# EAGLE design rs485_board (EAGLE 6.6.0)
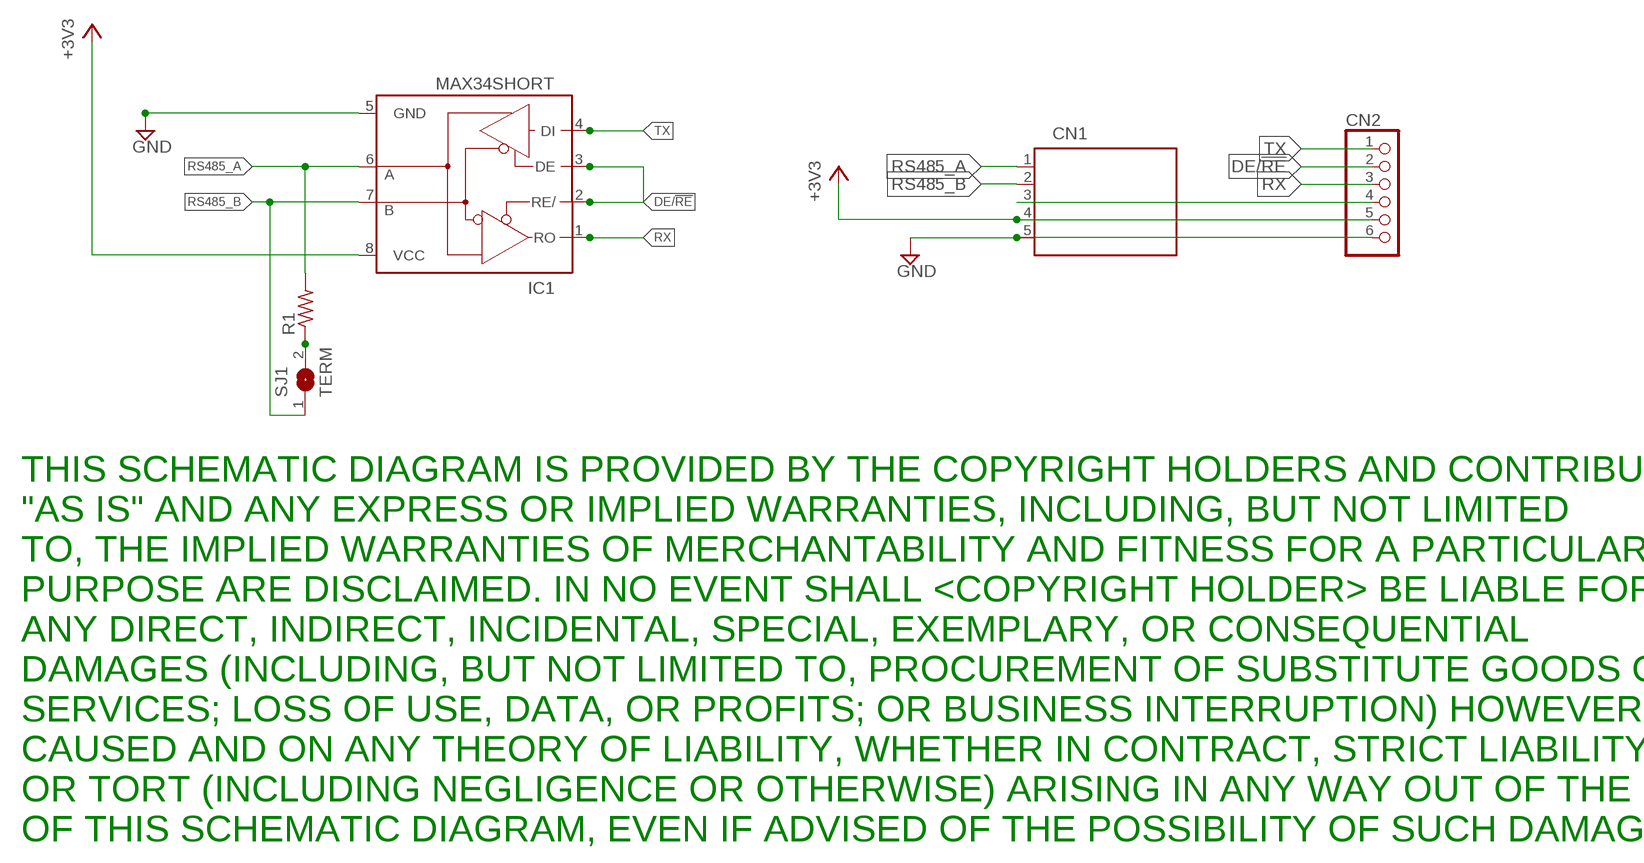
[diagram p0: schematic, sheet 1]

## Parts
CN1  5PINZH  [ZH-5]
CN2  PINHD-1X06_2.54  [1X06]
IC1  MAX34SHORT  [SO08SHORT]
R1  R-US_R0603  [R0603]
SJ1  TERM  SJ  [SJ]

## Nets
+3V3: CN1.4 CN2.5 IC1.8(VCC)
DE/!RE: CN2.2 IC1.2(RE/) IC1.3(DE)
GND: CN1.5 CN2.6 IC1.5(GND)
N$1: CN1.3 CN2.4
N$7: R1.1 SJ1.2
RS485_A: CN1.1 IC1.6(A) R1.2
RS485_B: CN1.2 IC1.7(B) SJ1.1
RX: CN2.3 IC1.1(RO)
TX: CN2.1 IC1.4(DI)

## Notes on the sheet
- THIS SCHEMATIC DIAGRAM IS PROVIDED BY THE COPYRIGHT HOLDERS AND CONTRIBUTORS 
  "AS IS" AND ANY EXPRESS OR IMPLIED WARRANTIES, INCLUDING, BUT NOT LIMITED 
  TO, THE IMPLIED WARRANTIES OF MERCHANTABILITY AND FITNESS FOR A PARTICULAR 
  PURPOSE ARE DISCLAIMED. IN NO EVENT SHALL <COPYRIGHT HOLDER> BE LIABLE FOR 
  ANY DIRECT, INDIRECT, INCIDENTAL, SPECIAL, EXEMPLARY, OR CONSEQUENTIAL 
  DAMAGES (INCLUDING, BUT NOT LIMITED TO, PROCUREMENT OF SUBSTITUTE GOODS OR 
  SERVICES; LOSS OF USE, DATA, OR PROFITS; OR BUSINESS INTERRUPTION) HOWEVER 
  CAUSED AND ON ANY THEORY OF LIABILITY, WHETHER IN CONTRACT, STRICT LIABILITY,
  OR TORT (INCLUDING NEGLIGENCE OR OTHERWISE) ARISING IN ANY WAY OUT OF THE USE
  OF THIS SCHEMATIC DIAGRAM, EVEN IF ADVISED OF THE POSSIBILITY OF SUCH DAMAGE.

## Library data of the parts
CN1 = con-jst:5PIN
CN2 = pinhead-2:PINHD-1X06: PIN HEADER
IC1 = maxim:MAX34*: +5V, Fail-Safe, 40Mbps, Profibus RS-485/RS-422 Transceivers Source: MAX3465-MAX3469.pdf
R1 = rcl:R-US_: RESISTOR, American symbol
SJ1 = jumper:SJ: SMD solder JUMPER

## Net classes
1 power: width 0.254 mm, drill 0.33 mm, clearance 0.152 mm

## Board
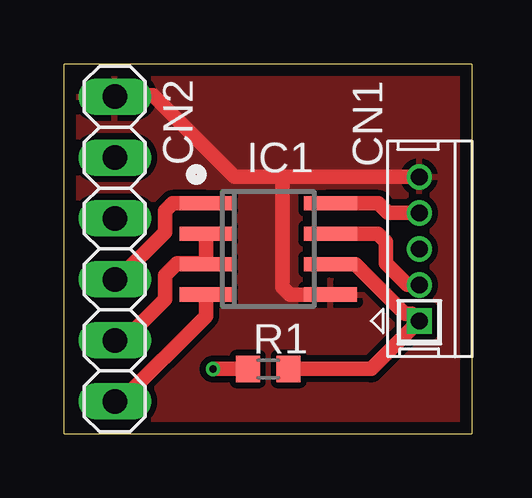
[diagram p1: board, top side]
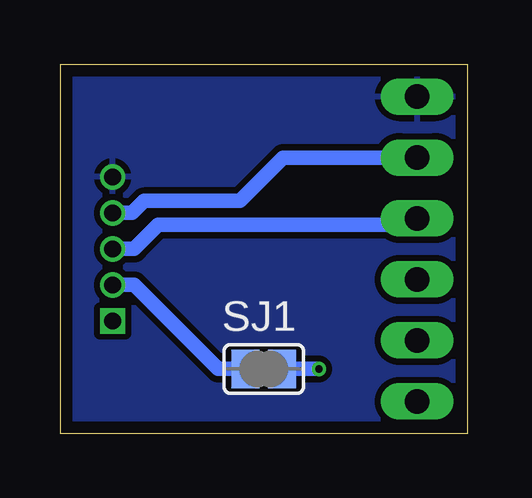
[diagram p2: board, bottom side, seen from below]

Size 17 x 15.4 mm. Coordinates in mm from the lower left corner, seen from the top.
Outline: 0,0 17,0 17,15.4 0,15.4 0,0
Copper layers (1*16): Top 0.035mm / dielectric 1.53mm / Bottom 0.035mm
Design rules "pban_5mil-l2": minimum track width 5mil, minimum drill 0.3mm, track to track 5mil, track to pad 0.229mm, pad to pad 5mil, via to via 5mil, smd to smd 5mil, copper to edge 0.5mm, drill to drill 0.5mm, minimum pad ring 0.15mm, minimum via ring 0.15mm, stop-mask expansion 4mil, vias tented up to drill 0.35mm, thermal gap 10mil

### Footprints (pad centres in the part's own frame; a part is rotated, then mirrored left to right if it is on the bottom)
ZH-5 = drill 0.7 square: 1 -4.5,0 | drill 0.7: 2 -3,0; 3 -1.5,0; 4 0,0; 5 1.5,0
1X06 = drill 1.016 long: 1 -6.35,0; 2 -3.81,0; 3 -1.27,0; 4 1.27,0; 5 3.81,0; 6 6.35,0
SO08SHORT = smd 0.6 x 2.2: 1 -1.905,-2.6; 2 -0.635,-2.6; 3 0.635,-2.6; 4 1.905,-2.6; 5 1.905,2.6; 6 0.635,2.6; 7 -0.635,2.6; 8 -1.905,2.6
R0603 = smd 1 x 1.1: 1 -0.85,0; 2 0.85,0
SJ = smd 1.168 x 1.6: 1 -0.762,0; 2 0.762,0

### Placement (x,y rotation side)
CN1  14.8,9.2 90 top
CN2  2.1,7.7 90 top
IC1  8.5,7.7 270 top
R1  8.5,2.7 0 top
SJ1  8.5,2.7 0 bottom

### Tracks (layer width: path | path; a pad name or v marks a point on that pad's centre or on a via)
+3V3
  Top 0.61: CN1.4 13.5,9.2 13.1,9.6 10.9,9.6 IC1.8
  Bottom 0.61: CN2.5 7.69,11.51 9.5,9.7 13.5,9.7 14,9.2 CN1.4
DE/!RE
  Top 0.61: IC1.2 IC1.3 5.67,7.1 4.7,7.1 4.2,6.6 4.2,5.6 2.49,3.89 CN2.2
GND
  Top 0.61: CN1.5 9.1,10.7 | 9.1,10.7 7.1,10.7 3.7,14.1 1.85,14.1 CN2.6 | IC1.5 9.4,5.79 9.1,6.1 9.1,10.7
  pour Top (isolate 0.254): -0.1,-0.1 17.1,-0.1 17.1,15.5 -0.1,15.5
  pour Bottom (isolate 0.254): -0.2,-0.1 17.2,-0.1 17.2,15.5 -0.2,15.5
N$1
  Bottom 0.61: CN1.3 13.9,7.7 12.9,8.7 2.07,8.7 CN2.4
N$7  (via drill 0.3)
  Top 0.61: v6.2,2.7 R1.1
  Bottom 0.61: SJ1.2 v6.2,2.7
RS485_A
  Top 0.61: R1.2 12.8,2.7 CN1.1 14.5,5 14.2,5 12.13,7.07 IC1.6
RS485_B
  Top 0.61: IC1.7 13.06,8.34 13.4,8 13.4,7.1 14.3,6.2 CN1.2
  Bottom 0.61: CN1.2 13.9,6.2 10.4,2.7 SJ1.1
RX
  Top 0.61: IC1.1 4.5,9.61 4.2,9.3 4.2,8.4 2.23,6.43 CN2.3
TX
  Top 0.61: CN2.1 2.35,1.35 5.9,4.9 IC1.4

### Text on the board
Top: THIS PCB LAYOUT IS PROVIDED BY THE COPYRIGHT HOLDERS AND CONTRIBUTORS "AS IS" / AND ANY EXPRESS OR IMPLIED WARRANTIES, INCLUDING, BUT NOT LIMITED TO, THE / IMPLIED WARRANTIES OF MERCHANTABILITY AND FITNESS FOR A PARTICULAR PURPOSE / ARE DISCLAIMED. IN NO EVENT SHALL <COPYRIGHT HOLDER> BE LIABLE FOR ANY / DIRECT, INDIRECT, INCIDENTAL, SPECIAL, EXEMPLARY, OR CONSEQUENTIAL DAMAGES / (INCLUDING, BUT NOT LIMITED TO, PROCUREMENT OF SUBSTITUTE GOODS OR SERVICES; / LOSS OF USE, DATA, OR PROFITS; OR BUSINESS INTERRUPTION) HOWEVER CAUSED AND / ON ANY THEORY OF LIABILITY, WHETHER IN CONTRACT, STRICT LIABILITY, OR TORT / (INCLUDING NEGLIGENCE OR OTHERWISE) ARISING IN ANY WAY OUT OF THE USE OF THIS / PCB LAYOUT, EVEN IF ADVISED OF THE POSSIBILITY OF SUCH DAMAGE.